# Altium schematic sheet LCD12864.SchDoc
size A4
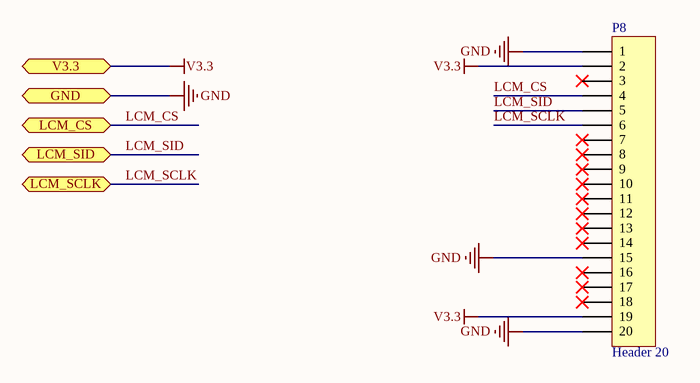
[diagram p0: LCD12864.SchDoc]

## Parts
P8  Header 20  [HDR1X20]

## Ports
GND, LCM_CS, LCM_SCLK, LCM_SID, V3.3

## Nets
GND: P8.1 P8.15 P8.20 ; port GND
V3.3: P8.2 P8.19 ; port V3.3
LCM_CS: P8.4 ; port LCM_CS
LCM_SCLK: P8.6 ; port LCM_SCLK
LCM_SID: P8.5 ; port LCM_SID

Not connected (* = marked no-connect by the designer): P8 3* 7* 8* 9* 10* 11* 12* 13* 14* 16* 17* 18*

## Library data of the parts
P8 = Header 20: Header, 20-Pin; LatestRevisionDate: 17-Jul-2002; LatestRevisionNote: Re-released for DXP Platform.; Publisher: Altium Limited